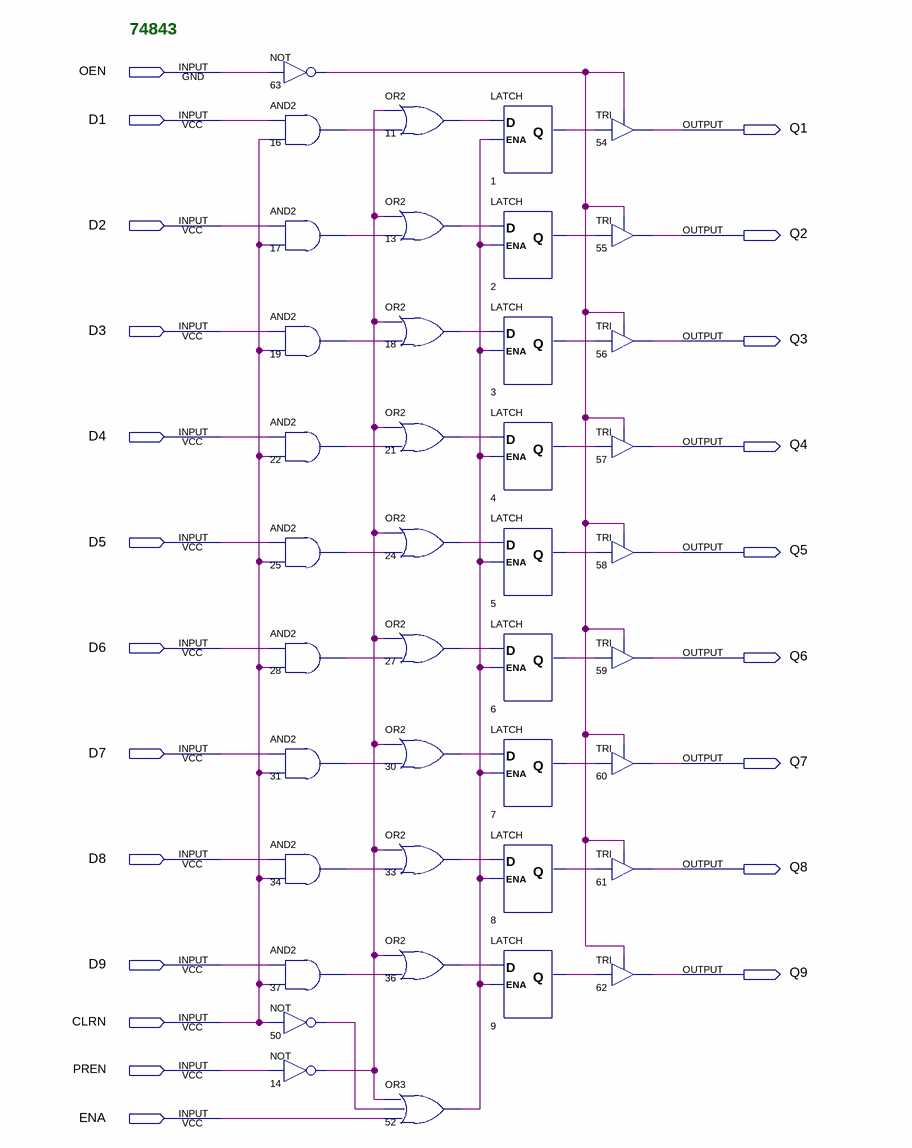
[diagram p0: schematic sheet]
// Quartus schematic 74843.bdf as structural Verilog: 40 symbols, 22 pins
module \74843  (
  input  OEN,
  input  D1,
  input  D2,
  input  D3,
  input  D4,
  input  D5,
  input  D6,
  input  D7,
  input  D8,
  input  D9,
  input  CLRN,
  input  PREN,
  input  ENA,
  output Q1,
  output Q2,
  output Q3,
  output Q4,
  output Q5,
  output Q6,
  output Q7,
  output Q8,
  output Q9
);

  wire n1_q, n2_q, n3_q, n4_q, n5_q, n6_q, n7_q, n8_q, n9_q, n11_out, n13_out, n14_out, n16_out, n17_out,
       n18_out, n19_out, n21_out, n22_out, n24_out, n25_out, n27_out, n28_out, n30_out, n31_out, n33_out,
       n34_out, n36_out, n37_out, n50_out, n52_out, n63_out;

  not u_63 (n63_out, OEN);
  and u_16 (n16_out, D1, CLRN);
  and u_17 (n17_out, D2, CLRN);
  and u_19 (n19_out, D3, CLRN);
  and u_22 (n22_out, D4, CLRN);
  and u_25 (n25_out, D5, CLRN);
  and u_28 (n28_out, D6, CLRN);
  and u_31 (n31_out, D7, CLRN);
  and u_34 (n34_out, D8, CLRN);
  and u_37 (n37_out, D9, CLRN);
  not u_50 (n50_out, CLRN);
  not u_14 (n14_out, PREN);
  or u_11 (n11_out, n14_out, n16_out);
  or u_13 (n13_out, n14_out, n17_out);
  or u_18 (n18_out, n14_out, n19_out);
  or u_21 (n21_out, n14_out, n22_out);
  or u_24 (n24_out, n14_out, n25_out);
  or u_27 (n27_out, n14_out, n28_out);
  or u_30 (n30_out, n14_out, n31_out);
  or u_33 (n33_out, n14_out, n34_out);
  or u_36 (n36_out, n14_out, n37_out);
  or u_52 (n52_out, n14_out, n50_out, ENA);
  LATCH u_1 (.D(n11_out), .ENA(n52_out), .Q(n1_q));
  LATCH u_2 (.D(n13_out), .ENA(n52_out), .Q(n2_q));
  LATCH u_3 (.D(n18_out), .ENA(n52_out), .Q(n3_q));
  LATCH u_4 (.D(n21_out), .ENA(n52_out), .Q(n4_q));
  LATCH u_5 (.D(n24_out), .ENA(n52_out), .Q(n5_q));
  LATCH u_6 (.D(n27_out), .ENA(n52_out), .Q(n6_q));
  LATCH u_7 (.D(n30_out), .ENA(n52_out), .Q(n7_q));
  LATCH u_8 (.D(n33_out), .ENA(n52_out), .Q(n8_q));
  LATCH u_9 (.D(n36_out), .ENA(n52_out), .Q(n9_q));
  TRI u_54 (.IN(n1_q), .OE(n63_out), .OUT(Q1));
  TRI u_55 (.IN(n2_q), .OE(n63_out), .OUT(Q2));
  TRI u_56 (.IN(n3_q), .OE(n63_out), .OUT(Q3));
  TRI u_57 (.IN(n4_q), .OE(n63_out), .OUT(Q4));
  TRI u_58 (.IN(n5_q), .OE(n63_out), .OUT(Q5));
  TRI u_59 (.IN(n6_q), .OE(n63_out), .OUT(Q6));
  TRI u_60 (.IN(n7_q), .OE(n63_out), .OUT(Q7));
  TRI u_61 (.IN(n8_q), .OE(n63_out), .OUT(Q8));
  TRI u_62 (.IN(n9_q), .OE(n63_out), .OUT(Q9));

  // Notes on the sheet:
  //   74843
endmodule
